# Altium schematic sheet ETHERNET.SchDoc
size A; SheetNumber: 8; SheetTotal: 9
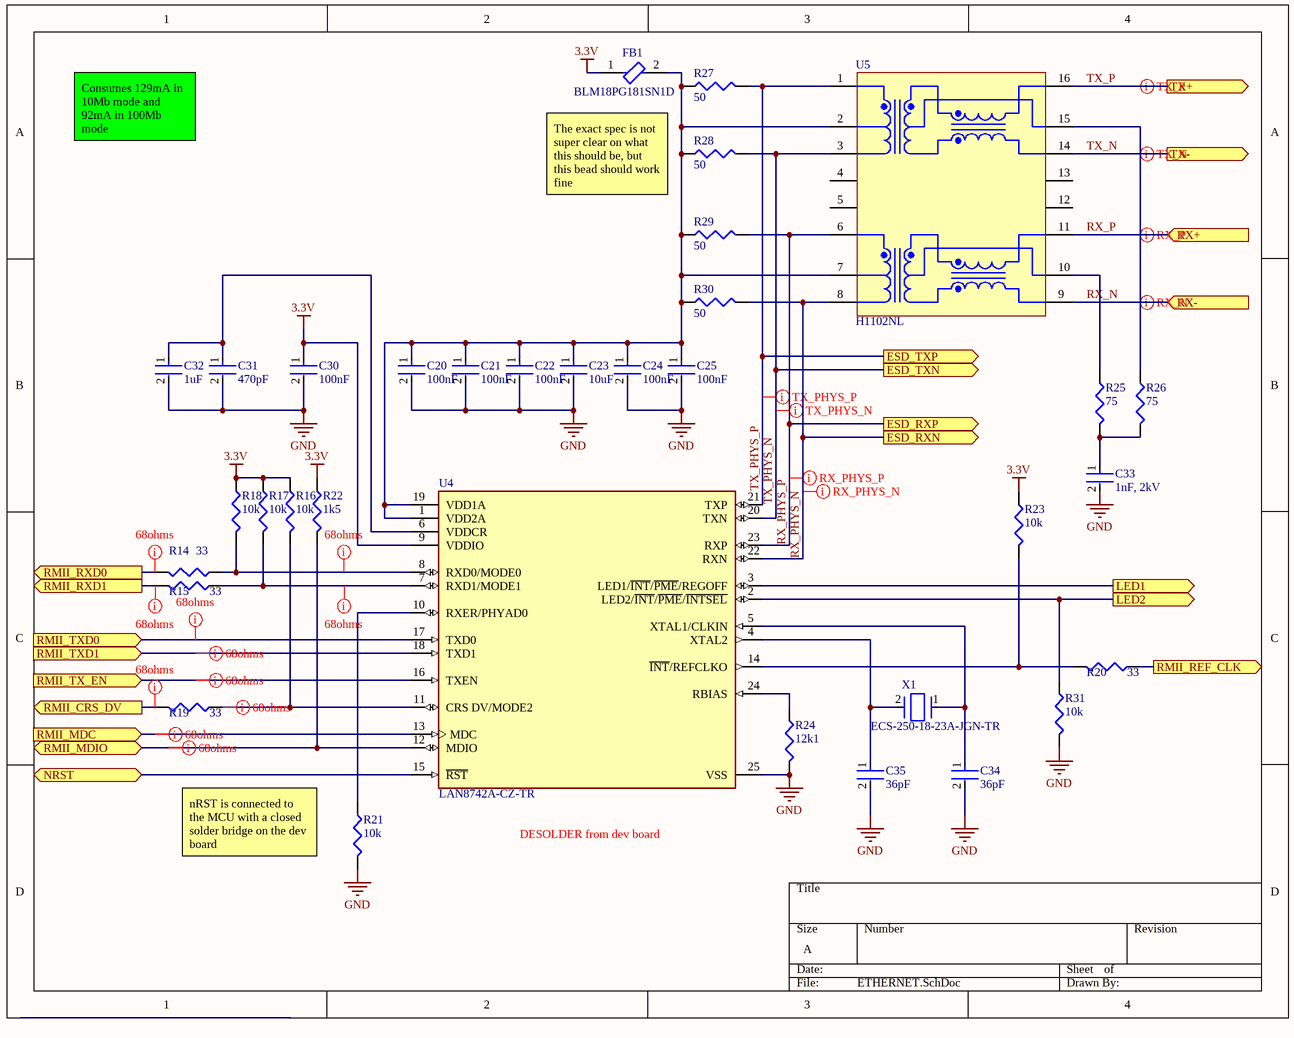
[diagram p0: ETHERNET.SchDoc]

## Parts
C20  100nF  [FP-C0603C-CF-MFG]
C21  100nF  [FP-C0603C-CF-MFG]
C22  100nF  [FP-C0603C-CF-MFG]
C23  10uF  [FP-C0603C-CF-MFG]
C24  100nF  [FP-C0603C-CF-MFG]
C25  100nF  [FP-C0603C-CF-MFG]
C30  100nF  [FP-C0603C-CF-MFG]
C31  470pF  [FP-C0603C-CF-MFG]
C32  1uF  [FP-C0603C-CF-MFG]
C33  1nF, 2kV  [FP-C0603C-CF-MFG]
C34  36pF  [FP-C0603C-CF-MFG]
C35  36pF  [FP-C0603C-CF-MFG]
FB1  BLM18PG181SN1D  [FP-BLM18-0_15-t0_8-IPC_B]
R14  33  [J1-0603]
R15  33  [J1-0603]
R16  10k  [J1-0603]
R17  10k  [J1-0603]
R18  10k  [J1-0603]
R19  33  [J1-0603]
R20  33  [J1-0603]
R21  10k  [J1-0603]
R22  1k5  [J1-0603]
R23  10k  [J1-0603]
R24  12k1  [J1-0603]
R25  75  [J1-0603]
R26  75  [J1-0603]
R27  50  [J1-0603]
R28  50  [J1-0603]
R29  50  [J1-0603]
R30  50  [J1-0603]
R31  10k  [J1-0603]
U4  LAN8742A-CZ-TR  [FP-C04-143B-S4QFN-MFG]
U5  H1102NL  [PULS-MODULE-16_V]
X1  ECS-250-18-23A-JGN-TR  [FP-ECX-64A-MFG]

## Ports
ESD_RXN (out), ESD_RXP (out), ESD_TXN (out), ESD_TXP (out), LED1 (out), LED2 (out), NRST (bidir), RMII_CRS_DV (out), RMII_MDC (in), RMII_MDIO (bidir), RMII_REF_CLK (out), RMII_RXD0 (out), RMII_RXD1 (out), RMII_TX_EN (in), RMII_TXD0 (in), RMII_TXD1 (in), RX+ (in), RX- (in), TX+ (out), TX- (out)

## Nets
3.3V: C30.1 FB1.1 R16.1 R17.1 R18.1 R22.1 R23.1 U4.9(VDDIO)
GND: C20.2 C21.2 C22.2 C23.2 C24.2 C25.2 C30.2 C31.2 C32.2 C33.2 C34.2 C35.2 R21.2 R24.2 R31.2 U4.25(VSS)
LED1: U4.3(LED1/~{INT}/~{PME}/REGOFF) ; port LED1
LED2: R31.1 U4.2(LED2/~{INT}/~{PME}/~{INTSEL}) ; port LED2
NRST: U4.15(~{RST}) ; port NRST
RMII_CRS_DV: R19.2 ; port RMII_CRS_DV
RMII_MDC: U4.13(MDC) ; port RMII_MDC
RMII_MDIO: R22.2 U4.12(MDIO) ; port RMII_MDIO
RMII_REF_CLK: R20.1 ; port RMII_REF_CLK
RMII_RXD0: R14.2 ; port RMII_RXD0
RMII_RXD1: R15.2 ; port RMII_RXD1
RMII_TX_EN: U4.16(TXEN) ; port RMII_TX_EN
RMII_TXD0: U4.17(TXD0) ; port RMII_TXD0
RMII_TXD1: U4.18(TXD1) ; port RMII_TXD1
RX_N: U5.9 ; port RX-
RX_P: U5.11 ; port RX+
RX_PHYS_N: R30.2 U4.22(RXN) U5.8 ; port ESD_RXN
RX_PHYS_P: R29.2 U4.23(RXP) U5.6 ; port ESD_RXP
TX_N: U5.14 ; port TX-
TX_P: U5.16 ; port TX+
TX_PHYS_N: R28.2 U4.20(TXN) U5.3 ; port ESD_TXN
TX_PHYS_P: R27.2 U4.21(TXP) U5.1 ; port ESD_TXP
NetC20_1: C20.1 C21.1 C22.1 C23.1 C24.1 C25.1 FB1.2 R27.1 R28.1 R29.1 R30.1 U4.1(VDD2A) U4.19(VDD1A) U5.2 U5.7
NetC31_1: C31.1 C32.1 U4.6(VDDCR)
NetC33_1: C33.1 R25.2 R26.2
NetC34_1: C34.1 U4.5(XTAL1/CLKIN) X1.1(In/Out)
NetC35_1: C35.1 U4.4(XTAL2) X1.2(Out/In)
NetR14_1: R14.1 R18.2 U4.8(RXD0/MODE0)
NetR15_1: R15.1 R17.2 U4.7(RXD1/MODE1)
NetR16_2: R16.2 R19.1 U4.11(CRS_DV/MODE2)
NetR20_2: R20.2 R23.2 U4.14(~{INT}/REFCLKO)
NetR21_1: R21.1 U4.10(RXER/PHYAD0)
NetR24_1: R24.1 U4.24(RBIAS)
NetR25_1: R25.1 U5.10
NetR26_1: R26.1 U5.15

Not connected (* = marked no-connect by the designer): U5 4 5 12 13

## Layout directives
differential pair; differential pair class 100ohms: RX_N, RX_P, RX_PHYS_N, RX_PHYS_P, TX_N, TX_P, TX_PHYS_N, TX_PHYS_P
rule Impedance Constraint [Min = 67.00    Max = 69.00    ]; net class 68ohms: NetR14_1, NetR15_1, NetR16_2, RMII_CRS_DV, RMII_RXD0, RMII_TX_EN, RMII_TXD0, RMII_TXD1
rule Impedance Constraint [Min = 67.00    Max = 69.00    ]: RMII_MDC, RMII_MDIO, RMII_RXD1

## Notes on the sheet
- Consumes 129mA in 10Mb mode and 92mA in 100Mb mode
- The exact spec is not super clear on what this should be, but this bead should work fine
- DESOLDER from dev board
- (near R21) nRST is connected to the MCU with a closed solder bridge on the dev board

## Library data of the parts
C20-C25 C30-C35 = CMP-2006-03061-2: Any 0603 Cap is fine here; Manufacturer: KEMET; Manufacturer Part Number: C0603C104K5RACTU; Tolerance: 0.1; Temperature Coefficient: 30ppm/°C; Material: Ceramic; Automotive Grade: Grade 1; Voltage Rating: 50 V; Value: 0.10 μF; Temperature Characteristic: X7R; Temperature: -55°C to +125°C; RoHS: TRUE; Temperature Range High: +125°C; Lead Free: Yes; Octopart: https://octopart.com/c0603c104k5ractu-kemet-139244; Digikey Description: CAP CER 0.1UF 50V X7R 0603; Category: Cap; Package: C0603C-CF; ComponentLink2Description: Datasheet; Temperature Range Low: -55°C; Device Class L1: Passive Components; Automotive: Yes; Device Class L3: Ceramic Capacitors; ComponentLink2URL: https://api.kemet.com/component-edge/download/datasheet/C0603C100J5GACAUTO.pdf; Capacitance: 0.10 μF; Device Class L2: Capacitors; Height: 0.87mm
FB1 = CMP-0686-00566-4: Chip Ferrite Bead, 0603, 180Ω @ 100MHz, 0.09Ω, 25%, 1.5A; Number of Lines: 1; DC Resistance (DCR): 90mR; Shielding: Unshielded; Impedance: 180R; Depth: 0.8mm; Packaging: Tape and Reel; Width: 0.8mm; Current Rating: 1.5A; Min Operating Temperature: -55°C; Case Code (Metric): 1608; Case/Package: 0603; Max DC Current: 1.5A; Tolerance: 25%; Package Quantity: 1; Core Material: Ferrite; Number of Circuits: 1; Radiation Hardening: No; Height: 0.8mm; Max Operating Temperature: 125°C; Length: 1.6mm; Lead Free: Lead Free; REACH SVHC: No SVHC; Case Code (Imperial): 0603; Material: Ferrite; Max Current Rating: 1.5A; Termination: SMD/SMT; Number of Pins: 2; DC Current: 1.5A; Test Frequency: 100MHz
R14-R31 = Res3: Resistor; Published: 8-Jun-2000; LatestRevisionDate: 29-May-2009; LatestRevisionNote: IPC-7351 Footprint Added.; PackageReference: J1-0603; Publisher: Altium Limited; PackageDescription: Chip Resistor
  R14 R15 R19 R20: Value: 33
  R16-R18 R21 R23 R31: Value: 10K
  R22: Value: 1K5
  R24: Value: 12K1
  R25 R26: Value: 75
  R27-R30: Value: 50
U4 = CMP-06281-000006-2: IC TRANSCEIVER 1/1 24SQFN; Manufacturer: Microchip; Nominal Supply Current: 6.5-59mA; Max Supply Voltage: 3.6V; Number Of Channels: 1; Data Rate: 100Mbits/s; Interface: Ethernet,Other; Min Supply Voltage: 1.14V; Standoff Height: 0mm; Simplex Duplex: Full-Duplex; Rule: UNIONINDEX=0|RULEKIND=PlaneConnect|NETSCOPE=AnyNet|LAYERKIND=SameLayer|NAME=Schematic Power Plane Connect Style|PAD.PLANECONNECTSTYLE=Relief|PAD.RELIEFEXPANSION=20mil|PAD.RELIEFENTRIES=4|PAD.RELIEFCONDUCTORWIDTH=10mil|PAD.RELIEFAIRGAP=10mil|VIA.PLANECONNECTSTYLE=Direct|VIA.RELIEFEXPANSION=20mil|VIA.RELIEFENTRIES=4|VIA.RELIEFCONDUCTORWIDTH=10mil|VIA.RELIEFAIRGAP=10mil|UNIT=Imperial; Height: 1mm; Ambient Temperature Range High: +70°C; Category: IC; Mouser Description: Small Footprint RMII 10/100 Ethernet Transceiver with flexPWR Technology; Manufacturer Part Number: LAN8742A-CZ-TR; Digikey Description: IC TRANSCEIVER 1/1 24SQFN; Octopart: https://octopart.com/lan8742a-cz-tr-microchip-29030587; Temperature: 0°C to +70°C; Ambient Temperature Range Low: 0°C; Temperature Range Low: 0°C; ComponentLink2Description: Datasheet; Automotive: No; RoHS: TRUE; Device Class L3: Ethernet Interface ICs; Device Class L1: Integrated Circuits (ICs); Device Class L2: Interface ICs; Lead Free: Yes; Ipc Land Pattern Name: QFN50P400X400X90-24; ComponentLink2URL: http://ww1.microchip.com/downloads/en/DeviceDoc/DS_LAN8742_00001989A.pdf; Temperature Range High: +70°C; Package: C04-143B-S4QFN
U5 = CMP-2000-05322-1: 10/100 Base-T Single Port Surface Mount Magnetic with Turns Ratio, -40 to 85 degC, 16-Pin Module, RoHS, Tube; Manufacturer: Pulse; Unit Weight: 0.098767oz; Qualification: Commercial; Shielding: Unshielded; Isolation Voltage: 1.5kV; Frequency Range: 100kHzto100MHz; Width: 9.53m; Product Category: Audio&SignalTransformers; Number of Channels: Single; Package Reference: MODULE-16; Type: Module; Packaging: Tube; Application: 100Base-TX; Brand: Pulse; Datasheet URL: http://www.mouser.com/ds/2/336/H325-32121.pdf; Operating Temperature Range: 0Cto+70C; Termination Style: SMD/SMT; Product: LAN; Package Description: 16-Pin Surface Mount Device, Body 12.7 x 7.11 mm, Pitch 1.27 mm; Height: 6.09mm; Length: 12.7mm; Manufacturer URL: http://www.pulseelectronics.com/; Datasheet Version: Rev. H325.Q, 09/2009; RoHS: True
X1 = CMP-40224-000026-1: CRYSTAL 25.0000MHZ 18PF SMD; Frequency: 25MHz; Frequency Stability: 30ppm; Frequency Tolerance: 20ppm; ESR (Equivalent Series Resistance): 40R; Width: 0.138inch; Mount: Surface Mount; Load Capacitance: 18pF; Length: 0.236inch; Packaging: Cut Tape; Case/Package: SMD/SMT; Max Operating Temperature: 85°C; Height: 0.043inch; Min Operating Temperature: -40°C